# EAGLE design RH051.1 (EAGLE 7.7.0)
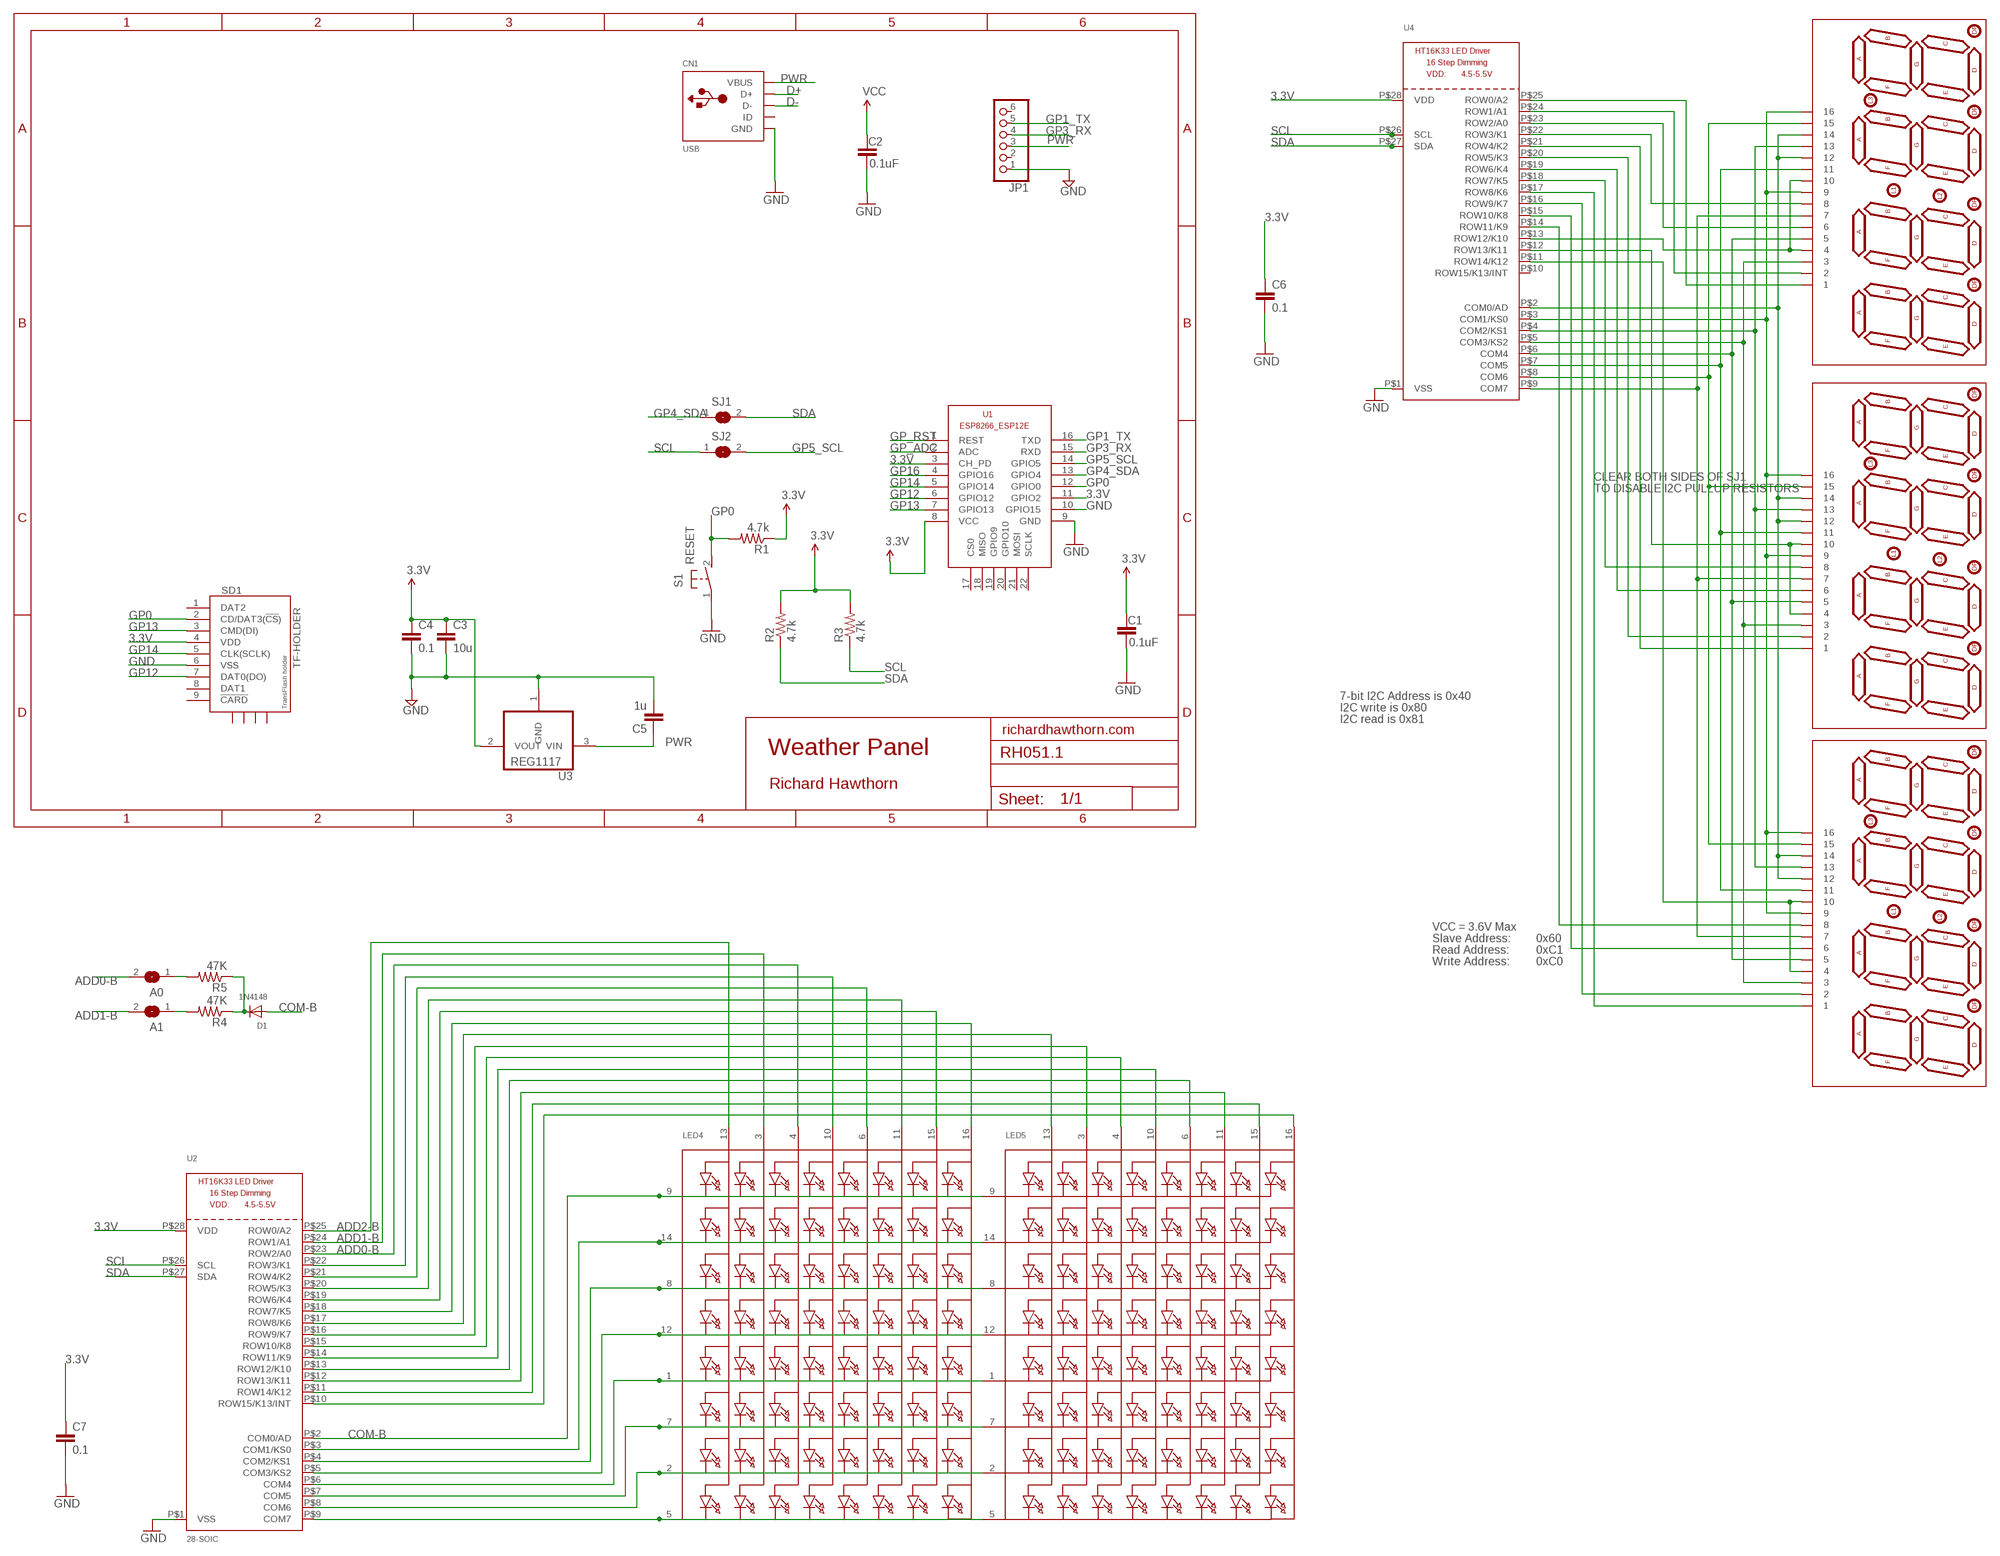
[diagram p0: schematic, sheet 1]

## Parts
A0  SOLDERJUMPERREFLOW_NOPASTE  [SOLDERJUMPER_REFLOW_NOPASTE]
A1  SOLDERJUMPERREFLOW_NOPASTE  [SOLDERJUMPER_REFLOW_NOPASTE]
C1  0.1uF  0.1UF-25V(+80/-20%)(0603)  [0603-CAP]
C2  0.1uF  0.1UF-25V(+80/-20%)(0603)  [0603-CAP]
C3  10u  CAP0805-CAP  [0805-CAP]
C4  0.1  CAP0603-CAP  [0603-CAP]
C5  1u  CAP0603-CAP  [0603-CAP]
C6  0.1  CAP0603-CAP  [0603-CAP]
C7  0.1  CAP0603-CAP  [0603-CAP]
CN1  USB  USBMINIB  [USB-MINIB]
D1  1N4148  DIODESOD-323F  [SOD-323F]
JP1  PINHD-1X6  [1X06]
LED1  7SEG-4DIGIT  [SPARKFUN_7-SEGMENT-4DIGIT]
LED2  7SEG-4DIGIT  [SPARKFUN_7-SEGMENT-4DIGIT]
LED3  7SEG-4DIGIT  [SPARKFUN_7-SEGMENT-4DIGIT]
LED4  DISP_SEGMENT_8X8_ROWCATHODEM12A881UR  [SEGMENT_BL-M12A881UR]
LED5  DISP_SEGMENT_8X8_ROWCATHODEM12A881UR  [SEGMENT_BL-M12A881UR]
R1  4.7k  RESISTOR0805-RES  [0805]
R2  4.7k  RESISTOR0805-RES  [0805]
R3  4.7k  RESISTOR0805-RES  [0805]
R4  47K  R-US_R0805  [R0805]
R5  47K  R-US_R0805  [R0805]
S1  RESET  DTSM-3  [DTSM-3]
SD1  TF-HOLDER  [TF-PULL]
SJ1  SJ  [SJ]
SJ2  SJ  [SJ]
U1  ESP8266-12EESP8266-ESP12E  [ESP8266-ESP12E]
U2  28-SOIC  HT16K33_SOP28  [SOP28_300MIL]
U3  REG1117  [SOT223]
U4  HT16K33_SOP28  [SOP28_300MIL]

## Nets
3.3V: C1.1 C2.1 C3.1 C4.1 C6.1 C7.1 R1.1 R2.2 R3.2 SD1.4(VDD) U1.3(CH_PD) U1.8(VCC) U1.11(GPIO2) U2.P$28(VDD) U3.2(VOUT) U4.P$28(VDD) ; supply symbol labelled VCC
ADD0-A: LED1.6 U4.P$23(ROW2/A0)
ADD0-B: A0.2 LED4.4(A3) U2.P$23(ROW2/A0)
ADD1-A: LED1.2 U4.P$24(ROW1/A1)
ADD1-B: A1.2 LED4.3(A2) U2.P$24(ROW1/A1)
ADD2-A: LED1.1 U4.P$25(ROW0/A2)
ADD2-B: LED4.13(A1) U2.P$25(ROW0/A2)
COM-A: LED1.12 LED1.14 LED2.12 LED2.14 LED3.12 LED3.14 U4.P$2(COM0/AD)
COM-B: D1.A LED4.9(K1) LED5.9(K1) U2.P$2(COM0/AD)
D+: CN1.D+
D-: CN1.D-
GND [power]: C1.2 C2.2 C3.2 C4.2 C5.2 C6.2 C7.2 CN1.GND JP1.1 S1.1 SD1.6(VSS) U1.9(GND) U1.10(GPIO15) U2.P$1(VSS) U3.1(GND) U4.P$1(VSS)
GP0: R1.2 S1.2 SD1.2(CD/DAT3(!CS!)) U1.12(GPIO0)
GP1_TX: JP1.5 U1.16(TXD)
GP3_RX: JP1.4 U1.15(RXD)
GP4_SDA: SJ1.1 U1.13(GPIO4)
GP5_SCL: SJ2.2 U1.14(GPIO5)
GP12: SD1.7(DAT0(DO)) U1.6(GPIO12)
GP13: SD1.3(CMD(DI)) U1.7(GPIO13)
GP14: SD1.5(CLK(SCLK)) U1.5(GPIO14)
GP16: U1.4(GPIO16)
GP_ADC: U1.2(ADC)
GP_RST: U1.1(REST)
N$1: LED4.5(K8) LED5.5(K8) U2.P$9(COM7)
N$2: LED4.2(K7) LED5.2(K7) U2.P$8(COM6)
N$3: LED4.7(K6) LED5.7(K6) U2.P$7(COM5)
N$4: LED1.9 LED1.16 LED2.9 LED2.16 LED3.9 LED3.16 U4.P$3(COM1/KS0)
N$5: LED1.13 LED2.13 LED3.13 U4.P$4(COM2/KS1)
N$6: LED1.3 LED2.3 LED3.3 U4.P$5(COM3/KS2)
N$7: LED1.5 LED2.5 LED3.5 U4.P$6(COM4)
N$8: LED1.11 LED2.11 LED3.11 U4.P$7(COM5)
N$9: LED1.15 LED2.15 LED3.15 U4.P$8(COM6)
N$10: LED1.7 LED2.7 LED3.7 U4.P$9(COM7)
N$11: LED4.1(K5) LED5.1(K5) U2.P$6(COM4)
N$12: LED4.8(K3) LED5.8(K3) U2.P$4(COM2/KS1)
N$13: LED4.14(K2) LED5.14(K2) U2.P$3(COM1/KS0)
N$14: LED1.8 U4.P$22(ROW3/K1)
N$15: LED2.1 U4.P$21(ROW4/K2)
N$16: LED2.2 U4.P$20(ROW5/K3)
N$17: LED2.6 U4.P$19(ROW6/K4)
N$18: LED2.8 U4.P$18(ROW7/K5)
N$19: LED3.1 U4.P$17(ROW8/K6)
N$21: LED3.2 U4.P$16(ROW9/K7)
N$22: LED3.6 U4.P$15(ROW10/K8)
N$23: LED3.8 U4.P$14(ROW11/K9)
N$24: LED1.4 LED1.10 U4.P$13(ROW12/K10)
N$25: LED2.4 LED2.10 U4.P$12(ROW13/K11)
N$26: LED3.4 LED3.10 U4.P$11(ROW14/K12)
N$28: LED5.15(A7) U2.P$11(ROW14/K12)
N$29: LED5.11(A6) U2.P$12(ROW13/K11)
N$30: LED4.16(A8) U2.P$18(ROW7/K5)
N$31: LED4.15(A7) U2.P$19(ROW6/K4)
N$32: LED4.6(A5) U2.P$21(ROW4/K2)
N$33: LED4.10(A4) U2.P$22(ROW3/K1)
N$34: LED5.16(A8) U2.P$10(ROW15/K13/INT)
N$35: LED4.11(A6) U2.P$20(ROW5/K3)
N$36: LED4.12(K4) LED5.12(K4) U2.P$5(COM3/KS2)
N$37: A1.1 R4.2
N$38: LED5.13(A1) U2.P$17(ROW8/K6)
N$39: LED5.3(A2) U2.P$16(ROW9/K7)
N$40: LED5.10(A4) U2.P$14(ROW11/K9)
N$41: LED5.4(A3) U2.P$15(ROW10/K8)
N$42: LED5.6(A5) U2.P$13(ROW12/K10)
N$43: A0.1 R5.2
N$44: D1.C R4.1 R5.1
PWR [power]: C5.1 CN1.VBUS JP1.3 U3.3(VIN)
SCL: R3.1 SJ2.1 U2.P$26(SCL) U4.P$26(SCL)
SDA: R2.1 SJ1.2 U2.P$27(SDA) U4.P$27(SDA)
Unconnected: CN1.ID JP1.2 JP1.6 SD1.1(DAT2) SD1.8(DAT1) SD1.9(!CARD) SD1.S1 SD1.S2 SD1.S3 SD1.S4 U1.17(CS0) U1.18(MISO) U1.19(GPIO9) U1.20(GPIO10) U1.21(MOSI) U1.22(SCLK) U4.P$10(ROW15/K13/INT)

## Notes on the sheet
- CLEAR BOTH SIDES OF SJ1
- TO DISABLE I2C PULLUP RESISTORS
- 7-bit I2C Address is 0x40
- I2C write is 0x80
- I2C read is 0x81
- richardhawthorn.com
- Weather Panel
- Richard Hawthorn
- VCC = 3.6V Max
- Slave Address: | 0x60
- Read Address: | 0xC1
- Write Address: | 0xC0

## Library data of the parts
A0 A1 = microbuilder:SOLDERJUMPER: SMD Solder JUMPER Solder the two pads together to create a connection, or remove the solder to break it. REFLOW - Use this footprint for solder paste and reflow ovens. WAVE - Use this footprint for hand-soldering (larger pads). CLOSED - Has a trace between the two pads to ensure it is closed by default. The trace needs to be cut to disable the jumper, and can be closed again by creating a solder bridge between the two pads.
C1 C2 = SparkFun-Capacitors:0.1UF-25V(+80/-20%)(0603): Ceramic Standard decoupling cap CAP-00810; PROD_ID: CAP-00810
C3-C7 = LowPowerLab:CAP: Capacitor Standard 0603 ceramic capacitor, and 0.1" leaded capacitor.
CN1 = LowPowerLab:USB: USB Connectors USBMINIB - Surface Mount Female Mini-B USB Connector 4UConnector: 06564 By microbuilder.eu Thru-hole RA Female Mini-B USB Connector 4UConnector: 18732 By ladyada.net
D1 = adafruit:DIODE: Diode SMADIODE - SMA Surface Mount Package 20V 1A Schottky Diode Digikey: 641-1014-6-ND DO-1N4148 - Through Hole Small Current Diode SOD-123 20V 1 A (.5mV Vf) Schottky Diode - Digikey: MBRX120TPMSCT-ND SOD-323 10V 570mA (.38mV Vf, 3ns) Schottky Diode - Digikey: ZLLS410CT-ND SOD-523 30V 30mA Schottky Diode (RB751S-40TE61) - Digikey: RB751S-40TE61CT-ND SOT23-R/W - SOT23 Package (R = Solder Paste/Reflow Ovens, W = Hand-Soldering) BAT54Film 40V 300mA - Digikey: 497-7162-1-ND
JP1 = Richards:PINHD-1X6: PIN HEADER
LED1-LED3 = sparkfun-4digit-sseg:7SEG-4DIGIT
LED4 LED5 = microbuilder:DISP_SEGMENT_8X8_ROWCATHODE: 8x8 LED Segment Displays: Row = Cathode 0.7" Red 8X8 Matrix, 1.9mm Round LEDs - BL-M07C881UR 1.2" Red 8x8 Matrix, 3.0mm Round LEDs - BL-M12A881UR 1.2" Red 8x8 Matrix, 3.0mm Square LEDs - BL-M12A883
R1-R3 = SparkFun:RESISTOR: Resistor Basic schematic elements and footprints for 0603, 1206, and PTH resistors.
R4 R5 = adafruit:R-US_: RESISTOR, American symbol
S1 = switch-tact:DTSM-3
SD1 = sd_mmc:TF-HOLDER: TF / Micro SD socket is PUSH-PUSH type, the card can be pushed into and auto locked and pushed out by simply press the card. Surface Mounting type.
SJ1 SJ2 = jumper:SJ: SMD solder JUMPER
U1 = ESP8266-ESP12E:ESP8266-12E: ESP8266-12E with additional I/O and GPIO04/05 corrected The author cannot warrant that this library is free from error or will meet your specific requirements. Created by PuceBaboon.com. Komagane, Nagano, JAPAN
U2 U4 = microbuilder:HT16K33_SOP28
U3 = burr-brown:REG1117: 800mA and 1A Low Dropout (LDO) Positive Regulator 1.8V, 2.5V, 2.85V, 3.3V, 5V, and Adj; MPN: REG1117; OC_FARNELL: 1097566; OC_NEWARK: 14P6981

## Net classes
1 power: width 0.381 mm, clearance 0.254 mm

## Board
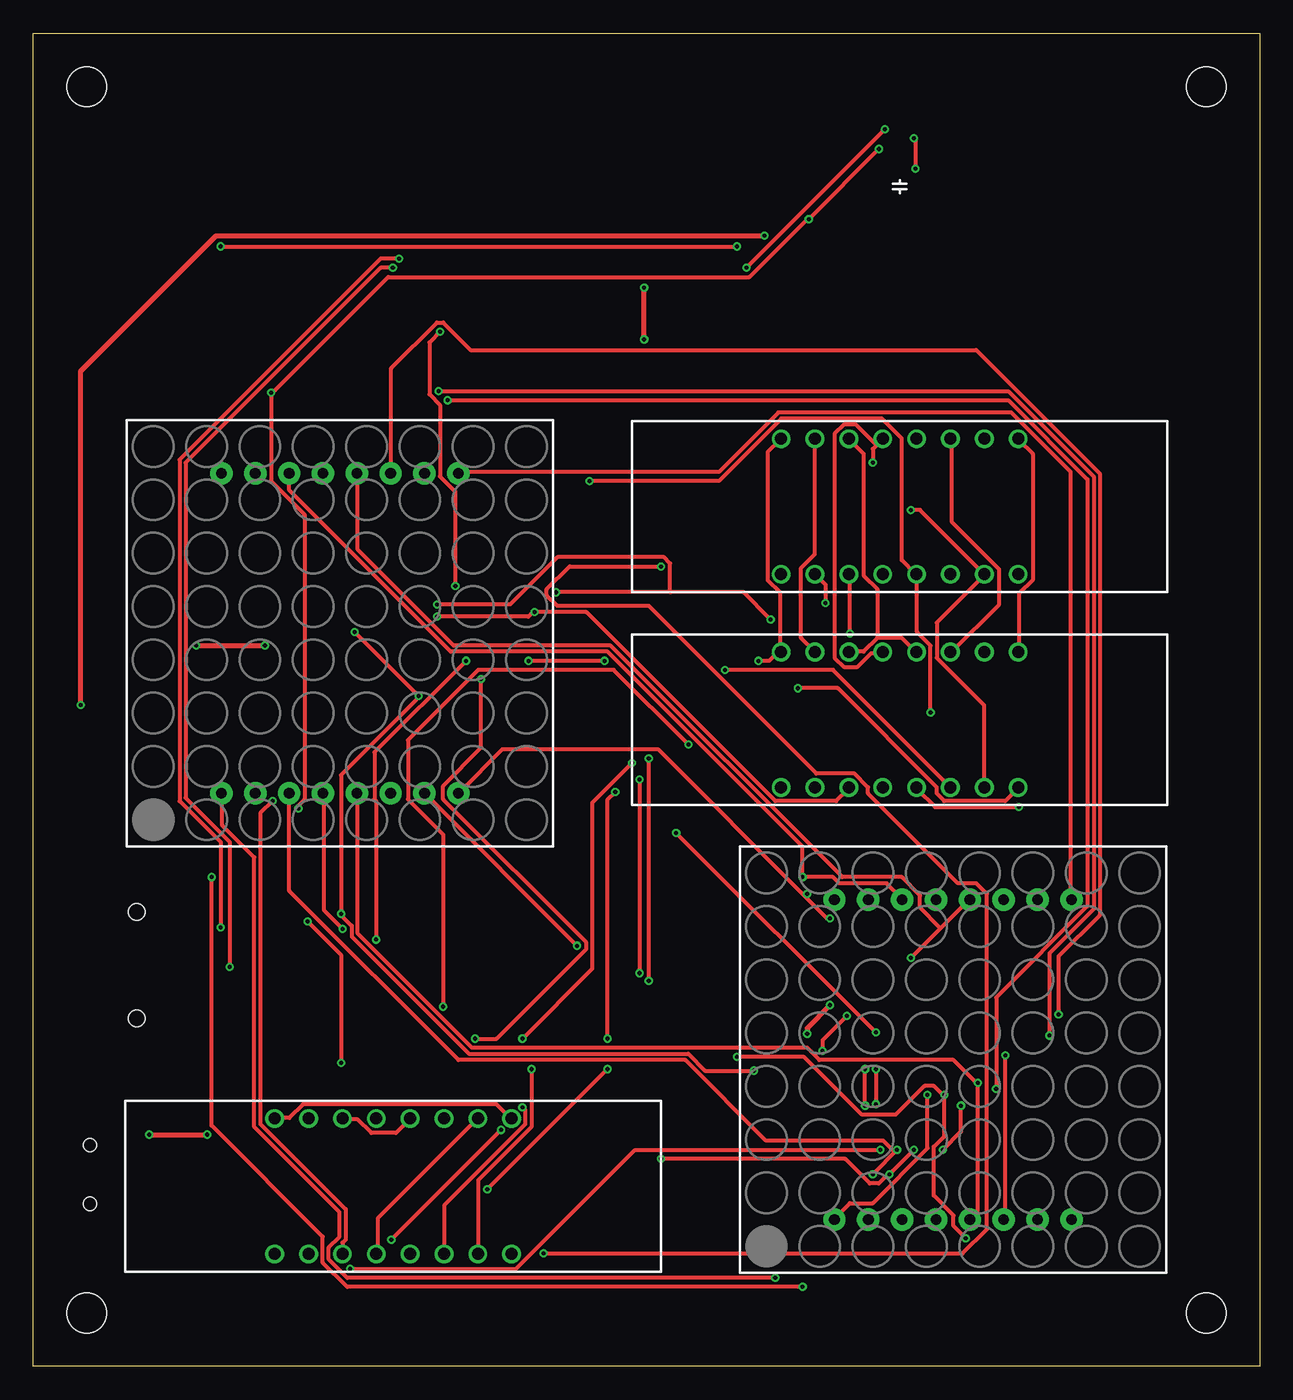
[diagram p1: board, top side]
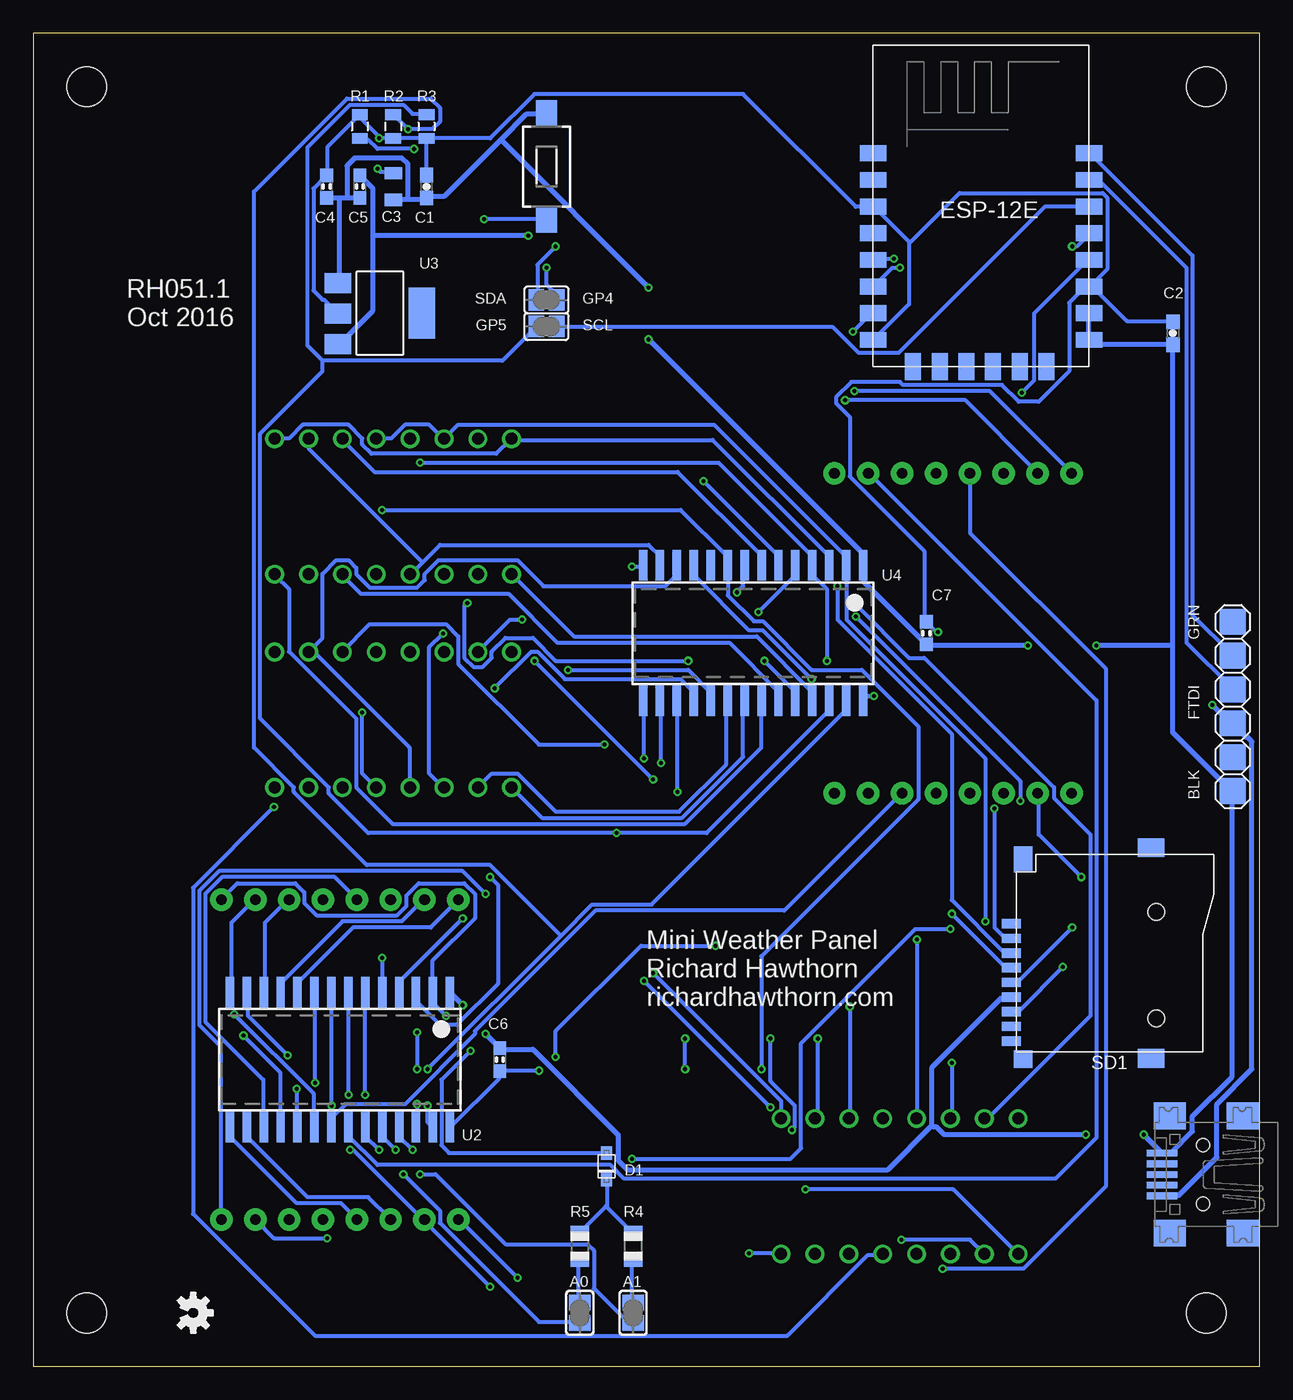
[diagram p2: board, bottom side, seen from below]

Size 92 x 100 mm. Coordinates in mm from the lower left corner, seen from the top.
Outline: 0,0 0,100 92,100 92,0 0,0
Copper layers (1*16): Top 0.035mm / dielectric 1.5mm / Bottom 0.035mm
Design rules "ITEADstudio_DRC *": minimum track width 12mil, minimum drill 12mil, track to track 6mil, track to pad 6mil, pad to pad 6mil, via to via 6mil, smd to smd 0mil, copper to edge 10mil, drill to drill 10mil, minimum pad ring 10mil, minimum via ring 6mil, stop-mask expansion 2mil, vias tented up to drill 100mil, thermal gap 15mil
Holes 3 mm at 4,96 88,96 4,4 88,4
tRestrict: area 0,92 to 35,100; area 0,0 to 8,8; area 84,0 to 92,8; area 84,92 to 92,100
bRestrict: area 0,92 to 35,100; area 84,92 to 92,100; area 84,0 to 92,8; area 0,0 to 8,8

### Footprints (pad centres in the part's own frame; a part is rotated, then mirrored left to right if it is on the bottom)
SOLDERJUMPER_REFLOW_NOPASTE = smd 1.168 x 1.6: 1 -0.762,0; 2 0.762,0
0603-CAP = smd 1.1 x 1: 1 -0.85,0; 2 0.85,0
0805-CAP = smd 0.902 x 1.3: 1 -1,0; 2 1,0
0603-CAP' = smd 1.016 x 0.965: 1 -0.85,0; 2 0.85,0
USB-MINIB = smd 0.5 x 2.308: D+ 0,4.064; D- -0.8,4.064; GND 1.6,4.064; ID 0.8,4.064; VBUS -1.6,4.064 | smd 2 x 2.4: GND1 -4.4,-2; GND2 -4.4,3.5; GND3 4.4,3.5; GND4 4.4,-2 | hole 1: -2.2,1; 2.2,1
SOD-323F = smd 1 x 0.8: A -1,0; C 1,0
1X06 = smd 1.93 x 1.93: 1 -6.35,0; 2 -3.81,0; 3 -1.27,0; 4 1.27,0; 5 3.81,0; 6 6.35,0
SPARKFUN_7-SEGMENT-4DIGIT = drill 0.9: 1 -8.89,-5.08; 2 -6.35,-5.08; 3 -3.81,-5.08; 4 -1.27,-5.08; 5 1.27,-5.08; 6 3.81,-5.08; 7 6.35,-5.08; 8 8.89,-5.08; 9 8.89,5.08; 10 6.35,5.08; 11 3.81,5.08; 12 1.27,5.08; 13 -1.27,5.08; 14 -3.81,5.08; 15 -6.35,5.08; 16 -8.89,5.08
SEGMENT_BL-M12A881UR = drill 0.8 pad 1.676: 1 -8.89,-12; 2 -6.35,-12; 3 -3.81,-12; 4 -1.27,-12; 5 1.27,-12; 6 3.81,-12; 7 6.35,-12; 8 8.89,-12; 9 8.89,12; 10 6.35,12; 11 3.81,12; 12 1.27,12; 13 -1.27,12; 14 -3.81,12; 15 -6.35,12; 16 -8.89,12
0805 = smd 0.8 x 1.2: 1 -0.9,0; 2 0.9,0
R0805 = smd 1.1 x 1.4: 1 -1,0; 2 1,0
DTSM-3 = smd 2 x 1.6: 1 -3.97,0; 2 3.97,0
TF-PULL = smd 0.7 x 1.4: 1 -2.2,-7.62; 2 -1.1,-7.62; 3 0,-7.62; 4 1.1,-7.62; 5 2.2,-7.62; 6 3.3,-7.62; 7 4.4,-7.62; 8 5.5,-7.62; 9 6.6,-7.62 | smd 1.4 x 2: S1 -7.9,2.85; S2 7.9,2.85 | smd 1.28 x 1.4: S3 7.96,-6.75 | smd 1.95 x 1.4: S4 -7.025,-6.75 | hole 1.25: -3.1,3.25; 4.9,3.25
SJ = smd 1.168 x 1.6: 1 -0.762,0; 2 0.762,0
ESP8266-ESP12E = smd 2 x 1.2: 1 0,16; 2 0,14; 3 0,12; 4 0,10; 5 0,8; 6 0,6; 7 0,4; 8 0,2; 9 16.2,2; 10 16.2,4; 11 16.2,6; 12 16.2,8; 13 16.2,10; 14 16.2,12; 15 16.2,14; 16 16.2,16 | smd 1.2 x 2: 17 11,0; 18 3,0; 19 5,0; 20 13,0; 21 7,0; 22 9,0
SOP28_300MIL = smd 0.635 x 2.286: P$1 -8.255,-5.08; P$2 -6.985,-5.08; P$3 -5.715,-5.08; P$4 -4.445,-5.08; P$5 -3.175,-5.08; P$6 -1.905,-5.08; P$7 -0.635,-5.08; P$8 0.635,-5.08; P$9 1.905,-5.08; P$10 3.175,-5.08; P$11 4.445,-5.08; P$12 5.715,-5.08; P$13 6.985,-5.08; P$14 8.255,-5.08; P$15 8.255,5.08; P$16 6.985,5.08; P$17 5.715,5.08; P$18 4.445,5.08; P$19 3.175,5.08; P$20 1.905,5.08; P$21 0.635,5.08; P$22 -0.635,5.08; P$23 -1.905,5.08; P$24 -3.175,5.08; P$25 -4.445,5.08; P$26 -5.715,5.08; P$27 -6.985,5.08; P$28 -8.255,5.08
SOT223 = smd 1.499 x 2.007: 1 -2.261,-3.15; 2 0.025,-3.15; 3 2.311,-3.15 | smd 3.81 x 2.007: 4 0,3.15

### Placement (x,y rotation side)
A0  51,4 270 bottom
A1  47,4 270 bottom
C1  62.5,88.5 270 bottom
C2  6.5,77.5 270 bottom
C3  65,88.5 270 bottom
C4  0.1  [0603-CAP']  70,88.5 270 bottom
C5  1u  [0603-CAP']  67.5,88.5 270 bottom
C6  0.1  [0603-CAP']  57,23 90 bottom
C7  0.1  [0603-CAP']  25,55 270 bottom
CN1  3.25,14.38 90 bottom
D1  49,15 270 bottom
JP1  2,49.5 90 bottom
LED1  65,64.5 0 top
LED2  65,48.5 0 top
LED3  27,13.5 0 top
LED4  23,55 0 top
LED5  69,23 0 top
R1  67.5,93 270 bottom
R2  65,93 270 bottom
R3  62.5,93 270 bottom
R4  47,9 270 bottom
R5  51,9 270 bottom
S1  53.5,90 270 bottom
SD1  11,31 270 bottom
SJ1  53.5,80 0 bottom
SJ2  53.5,78 0 bottom
U1  29,75 0 bottom
U2  69,23 180 bottom
U3  66,79 270 bottom
U4  38,55 180 bottom
U$3  [OSHW-LOGO-S]  80,4 270 bottom

### Tracks (layer width: path | path; a pad name or v marks a point on that pad's centre or on a via)
3.3V  (via drill 0.3)
  Top 0.305: v24.12,55.09 v28.92,50.29 28.92,50.18 23.09,44.35 v23.09,33.95 23.09,33.83 23.89,33.03 23.89,32.23 32.69,23.43 49.15,23.43 50.41,22.17 v54.06,22.17 | v66.18,89.84 66.18,92.01 v66.06,92.13
  Bottom 0.305: U2.P$28 60.69,17.95 57.04,21.6 57.04,22.06 C6.1 56.92,22.17 v54.06,22.17 | v24.12,55.09 24.23,55.09 24.92,55.78 C7.1 25.15,55.89 25.15,61.15 30.75,66.75 30.75,71.21 31.77,72.24 31.77,72.69 30.63,73.84 26.98,73.84 26.75,73.61 19.32,73.61 18.06,72.35 16.57,72.35 14.29,74.64 14.29,79.78 13.14,80.92 12.92,80.92 U1.11 | v28.92,50.29 29.38,50.29 29.72,49.95 U4.P$28 | v23.09,33.95 19.09,29.95 18.63,29.95 SD1.4 | C1.1 62.52,89.38 62.52,92.01 R3.2 | R3.2 62.64,92.13 64.92,92.13 R2.2 65.15,92.13 v66.06,92.13 66.06,92.24 67.55,93.73 R1.1 67.55,93.84 69.95,91.44 69.95,89.38 C4.1 70.07,89.27 70.98,88.35 70.98,80.7 70.29,80.01 70.18,80.01 U3.2 | v66.18,89.84 65.95,89.61 65.04,89.61 C3.1 | C2.1 6.51,78.41 9.94,78.41 12.46,80.92 12.69,80.92 U1.11 | 26.29,84.35 26.29,79.67 28.92,77.04 U1.8 | 26.29,84.35 28.92,86.98 U1.3 29.15,86.98 30.29,86.98 38.75,95.44 54.41,95.44 57.72,92.13 62.41,92.13 R3.2 | U1.11 12.46,81.04 12.46,81.27 11.43,82.3 11.43,87.67 11.77,88.01 22.52,88.01 26.18,84.35 26.29,84.35
ADD0-A
  Bottom 0.305: U4.P$23 36.12,49.95 36.12,50.63 39.78,54.29 52.69,54.29 56.35,57.95 67.44,57.95 68.81,59.32 LED1.6
ADD0-B  (via drill 0.3)
  Top 0.305: v66.06,16.23 v64.24,14.4 64.12,14.4 63.44,13.72 62.75,13.72 60.92,15.54 v47.09,15.54 | v23.2,32.8 21.83,34.18 21.83,42.98 LED4.4
  Bottom 0.305: v64.24,14.4 61.49,11.66 61.49,10.74 54.06,3.31 51.09,3.31 A0.2 | v66.06,16.23 67.09,17.26 67.09,17.83 U2.P$23 | v23.2,32.8 25.83,32.8 34.4,24.23 34.4,16.34 35.2,15.54 v47.09,15.54
ADD1-A  (via drill 0.3)
  Top 0.305: v42.86,52.92 v37.15,52.92 | v59.44,57.26 59.44,58.64 58.75,59.32 LED1.2
  Bottom 0.305: v37.15,52.92 34.86,50.63 34.86,49.95 U4.P$24 | v42.86,52.92 52.81,52.92 54.52,54.63 56.58,54.63 57.61,53.61 57.61,53.15 58.29,52.46 58.98,52.46 59.66,53.15 59.66,57.04 v59.44,57.26
ADD1-B  (via drill 0.3)
  Top 0.305: v62.98,14.4 v64.81,16.23 64.58,16.12 63.78,16.92 54.98,16.92 48.92,22.97 31.89,22.97 19.2,35.66 19.2,42.98 LED4.3
  Bottom 0.305: v62.98,14.4 61.84,14.4 56.58,9.14 50.41,9.14 49.95,8.69 49.95,5.83 47.43,3.31 47.09,3.31 A1.2 | v64.81,16.23 65.72,17.14 65.72,17.83 U2.P$24
ADD2-A
  Bottom 0.305: U4.P$25 33.6,49.95 33.6,50.63 37.72,54.75 51.44,54.75 56.01,59.32 LED1.1
ADD2-B  (via drill 0.3)
  Top 0.305: v63.55,16.23 45.15,16.23 36.23,7.32 v23.77,7.32
  Bottom 0.305: v63.55,16.23 64.47,17.14 64.47,17.83 U2.P$25 | v23.77,7.32 17.72,7.32 11.54,13.49 11.54,52.35 21.72,62.52 21.72,66.98 LED4.13
COM-A  (via drill 0.3)
  Top 0.305: 63.32,54.63 62.29,53.61 61.27,53.61 LED2.14 | 63.32,54.63 65.15,54.63 66.18,53.61 LED2.12 | LED3.14 23.2,18.52 24.35,18.52 25.38,17.49 27.2,17.49 28.23,18.52 LED3.12 | v23.09,22.75 23.09,30.86 v20.57,33.38 | 63.32,54.63 63.32,58.29 62.29,59.32 62.29,68.47 61.27,69.49 LED1.14
  Bottom 0.305: LED1.12 66.18,69.61 65.15,69.61 64.12,70.64 62.29,70.64 61.27,69.61 LED1.14 61.15,69.61 60.12,70.64 40.92,70.64 31.09,60.81 31.09,60.12 U4.P$2 30.98,60.01 30.98,56.01 20.57,45.61 v20.57,33.38 | v23.09,22.75 23.09,18.63 LED3.14
COM-B  (via drill 0.3)
  Top 0.305: v59.21,23.66 59.21,24.46 v61.04,26.29 | LED4.9 32,67.09 51.44,67.09 55.89,71.55 73.38,71.55 77.84,67.09 77.84,35.09 LED5.9
  Bottom 0.305: v59.21,23.66 61.38,21.49 61.38,16.57 60.81,16 49.03,16 D1.A | v61.04,26.29 61.95,27.2 61.95,28 U2.P$2 62.06,28.23 62.06,30.4 58.86,33.6 58.86,35.43 59.66,36.23 63.09,36.23 64.01,35.32 64.01,34.52 64.69,33.83 70.75,33.83 71.67,34.75 71.67,35.55 72.35,36.23 76.69,36.23 77.84,35.09 LED5.9
GND  (via drill 0.3)
  Top 0.381: v58.06,24.92 58.06,25.38 v59.78,27.09 | v12.23,54.06 v17.37,54.06 | v45.83,77.04 v45.83,80.92 | v8.69,17.37 v13.03,17.37
  Bottom 0.381: v58.06,24.92 57.04,23.89 C6.2 56.92,23.77 54.52,23.77 48.12,17.37 48.12,15.43 47.43,14.74 27.89,14.74 24.57,18.06 | v59.78,27.09 60.69,28 U2.P$1 | 24.57,18.06 24.57,22.4 19.32,27.66 18.63,27.66 SD1.6 | 69.04,87.67 69.95,87.67 C4.2 | 69.04,87.67 68.47,87.67 | 68.47,87.67 67.55,87.67 C5.2 | 69.04,87.67 69.04,81.27 U3.1 | 63.89,87.55 64.92,87.55 C3.2 | 63.89,87.55 62.52,87.55 C1.2 62.41,87.78 61.15,87.78 56.92,92.01 | 56.92,92.01 54.98,93.95 53.61,93.95 S1.1 | 68.47,87.67 68.47,90.07 67.89,90.64 64.35,90.64 63.89,90.18 63.89,87.55 | U1.10 12.8,78.98 12.8,77.15 U1.9 12.69,76.92 12.46,76.69 6.51,76.69 C2.2 6.51,76.47 6.51,54.06 | 6.51,54.06 6.51,47.55 2.17,43.2 JP1.1 2.06,43.09 2.06,21.72 5.03,18.75 5.03,17.6 6.63,16 7.2,16 CN1.GND 7.43,16.12 v8.69,17.37 | v17.37,54.06 24.92,54.06 C7.2 25.03,54.18 29.72,58.86 29.72,60.01 U4.P$1 29.83,60.24 29.83,61.04 v45.83,77.04 | 6.51,54.06 v12.23,54.06 | v45.83,80.92 56.92,92.01 | v13.03,17.37 23.66,17.37 24.23,17.95 24.46,17.95 24.57,18.06
GP0  (via drill 0.3)
  Top 0.305: v63.44,91.33 v58.18,86.07 58.06,86.07 53.72,81.72 26.63,81.72 17.95,73.04 v17.83,73.04 17.83,66.41 20.34,63.89 20.34,42.52 19.89,42.06 v19.89,41.83
  Bottom 0.305: v63.44,91.33 66.18,91.33 66.86,92.01 67.44,92.01 R1.2 | v58.18,86.07 53.61,86.07 S1.2 | v19.89,41.83 19.89,32.92 19.09,32.12 18.63,32.12 SD1.2 | v17.83,73.04 16.92,73.95 16.92,78.98 12.8,83.1 U1.12
GP1_TX
  Bottom 0.305: JP1.5 2.06,53.38 5.03,56.35 5.03,83.33 12.69,90.98 U1.16
GP3_RX
  Bottom 0.305: JP1.4 2.06,50.86 5.49,54.29 5.49,82.41 12,88.92 12.69,88.92 U1.15
GP4_SDA  (via drill 0.3)
  Top 0.305: v14.06,84.01 v52.81,84.01
  Bottom 0.305: v52.81,84.01 54.18,82.64 54.18,80.01 SJ1.1 | v14.06,84.01 13.72,84.01 12.8,84.92 U1.13
GP5_SCL
  Bottom 0.305: SJ2.2 52.69,77.95 32,77.95 30.06,76.01 27.09,76.01 16.12,86.98 12.8,86.98 U1.14
GP12  (via drill 0.3)
  Top 0.305: v14.74,29.95 14.74,39.32 11.43,42.63 11.43,67.78 26.06,82.41 v26.98,82.41
  Bottom 0.305: v14.74,29.95 18.06,26.63 18.52,26.63 SD1.7 | v26.98,82.41 27.55,82.41 28.92,81.04 U1.6
GP13  (via drill 0.3)
  Top 0.305: v31.66,58.52 31.66,65.61 30.52,66.75 30.52,72.12 29.72,72.92 29.72,76.81 v30.52,77.61
  Bottom 0.305: v31.66,58.52 31.66,56.01 23.09,47.43 23.09,34.98 19.2,31.09 18.63,31.09 SD1.3 | v30.52,77.61 29.03,79.1 U1.7
GP14  (via drill 0.3)
  Top 0.305: v14.06,32.92 14.06,39.32 10.97,42.41 10.97,68.01 26.06,83.1 v27.43,83.1
  Bottom 0.305: v14.06,32.92 18.17,28.8 18.52,28.8 SD1.5 | v27.43,83.1 28.92,83.1 U1.5
N$1  (via drill 0.3)
  Top 0.305: LED5.5 70.29,11.09 70.87,11.66 v70.87,21.26 70.75,21.26 69.04,22.97 58.98,22.97 58.06,23.89 32.92,23.89 24.35,32.46 24.35,42.98 LED4.5
  Bottom 0.305: v70.87,21.26 70.87,28 U2.P$9
N$2  (via drill 0.3)
  Top 0.305: v69.61,19.55 69.61,17.6 v68.24,16.23 | v13.37,36.69 13.37,18.06 21.72,9.72 21.72,7.77 23.55,5.94 v57.72,5.94
  Bottom 0.305: v69.61,19.55 69.61,28 U2.P$8 | v68.24,16.23 68.01,16.23 62.75,10.97 LED5.2 62.64,10.86 v57.72,5.94 | v13.37,36.69 16.57,39.89 16.57,42.98 LED4.2
N$3  (via drill 0.3)
  Top 0.305: v69.95,9.6 69.04,10.52 69.04,11.32 67.55,12.8 67.55,16.46 68.35,17.26 v68.35,20.34 68.24,20.34 67.55,21.03 66.86,21.03 64.69,18.86 62.18,18.86 57.84,23.2 v52.81,23.2 | v40.8,31.55 29.38,42.98 LED4.7
  Bottom 0.305: v68.35,20.34 68.35,28 U2.P$7 | v69.95,9.6 73.95,9.6 75.32,10.97 LED5.7 | v40.8,31.55 46.41,31.55 52.81,25.15 v52.81,23.2
N$4  (via drill 0.3)
  Top 0.305: LED3.16 18.17,18.63 19.2,18.63 20.23,19.66 34.75,19.66 35.78,18.63 LED3.9 | LED2.9 73.95,53.61 73.95,57.95 74.98,58.98 74.98,68.47 73.95,69.49 LED1.9 | LED1.16 56.01,69.49 55.09,68.58 55.09,58.98 56.01,58.06 56.01,53.61 LED2.16 55.89,53.61 55.21,52.92 v54.41,52.92 | v45.49,44.01 v45.49,29.49
  Bottom 0.305: U4.P$3 32.35,60.12 32.35,60.81 41.03,69.49 56.01,69.49 LED1.16 56.24,69.49 57.26,68.47 66.64,68.47 67.32,69.15 67.32,69.61 68.35,70.64 71.78,70.64 72.81,69.61 73.84,69.61 LED1.9 | v45.49,29.49 35.89,19.89 35.89,18.63 LED3.9 | v54.41,52.92 v45.49,44.01
N$5  (via drill 0.3)
  Top 0.305: v62.98,67.78 62.98,68.81 63.66,69.49 LED1.13 63.21,69.15 61.72,70.64 60.81,70.64 60.12,69.95 60.12,53.15 60.81,52.46 61.84,52.46 62.87,53.49 63.66,53.49 LED2.13 | v25.72,32 25.72,42.41 25.6,42.52 25.6,46.06 v32.46,52.92
  Bottom 0.305: v62.98,67.78 40.58,67.78 33.6,60.81 33.6,60.12 U4.P$4 33.49,60.01 33.49,59.32 32.46,58.29 v32.46,52.92 | v25.72,32 25.72,18.63 LED3.13
N$6  (via drill 0.3)
  Top 0.305: LED2.3 61.15,43.32 60.24,42.41 55.66,42.41 41.49,56.58 v37.6,56.58 37.49,56.58 37.15,56.24 v30.29,56.24 | v17.95,42.41 17.03,41.49 17.03,18.17 23.43,11.77 23.43,9.49 23.2,9.26 23.2,8.46 LED3.3 | v61.27,54.98 61.27,59.32 LED1.3
  Bottom 0.305: v37.6,56.58 34.86,59.32 34.86,60.01 U4.P$5 | v17.95,42.41 17.95,43.89 v30.29,56.24 | v61.27,54.98 62.29,53.95 62.29,44.46 61.27,43.43 LED2.3
N$7  (via drill 0.3)
  Top 0.305: v41.72,66.41 51.44,66.41 56.12,71.09 63.66,71.09 65.15,69.61 65.15,60.47 66.18,59.44 LED1.5 66.29,59.32 66.29,55.09 67.32,54.06 v67.32,49.03 | v73.95,41.95 67.67,41.95 66.29,43.32 LED2.5
  Bottom 0.305: v41.72,66.41 36.12,60.81 36.12,60.12 U4.P$6 | v73.95,41.95 80.01,35.89 80.01,11.43 70.87,2.29 35.43,2.29 29.38,8.34 28.35,8.34 LED3.5 | v67.32,49.03 67.32,44.46 66.29,43.43 LED2.5
N$8  (via drill 0.3)
  Top 0.305: v30.75,26.98 30.75,39.89 28.12,42.52 28.12,46.98 33.38,52.23 43.55,52.23 v49.15,46.63 | LED1.11 68.92,69.49 68.92,63.32 72.47,59.78 72.47,57.15 68.92,53.61 LED2.11
  Bottom 0.305: U4.P$7 37.38,60.12 37.38,60.81 43.66,67.09 66.41,67.09 68.81,69.49 LED1.11 | v30.75,26.98 30.75,18.63 LED3.11 | v49.15,46.63 54.06,46.63 60.12,52.69 60.12,54.75 61.04,55.66 66.75,55.66 68.81,53.61 LED2.11
N$9  (via drill 0.3)
  Top 0.305: 47.78,58.06 53.26,58.06 v55.32,56.01 | 47.78,58.06 v39.2,58.06 | v30.29,57.15 35.78,57.15 39.32,60.69 47.32,60.69 47.78,60.24 47.78,58.06 | LED1.15 58.64,69.49 58.64,60.92 57.61,59.89 57.61,54.63 58.64,53.61 LED2.15
  Bottom 0.305: v39.2,58.06 38.75,58.52 38.75,60.01 U4.P$8 | v55.32,56.01 56.24,56.01 58.64,53.61 LED2.15 | v30.29,57.15 26.29,53.15 25.15,53.15 15.43,43.43 15.43,42.63 12.69,39.89 12.69,26.29 20.34,18.63 20.57,18.63 LED3.15
N$10  (via drill 0.3)
  Top 0.305: v65.84,64.24 66.52,64.24 71.32,59.44 LED1.7 71.32,59.32 67.78,55.78 67.78,53.15 71.32,49.61 71.32,43.43 LED2.7 | v37.38,22.29 37.38,17.95 33.38,13.95 33.38,8.46 LED3.7
  Bottom 0.305: v65.84,64.24 43.43,64.24 40.01,60.81 40.01,60.12 U4.P$9 39.89,60.01 39.89,57.84 37.95,55.89 37.26,55.89 33.6,52.23 29.83,52.23 25.6,48.01 25.6,42.52 37.38,30.75 v37.38,22.29
N$11  (via drill 0.3)
  Top 0.305: v67.09,20.34 67.09,16.34 62.98,12.23 61.27,12.23 60.12,11.09 LED5.1 | v55.66,6.63 23.55,6.63 22.17,8 22.17,8.91 22.97,9.72 22.97,11.54 16.57,17.95 16.57,38.18 14.17,40.58 14.17,42.98 LED4.1
  Bottom 0.305: v67.09,20.34 67.09,28 U2.P$6 | v55.66,6.63 60.01,10.97 LED5.1
N$12  (via drill 0.3)
  Top 0.305: v59.78,33.6 59.55,33.6 57.89,35.26 | 57.89,35.26 46.86,46.29 35.2,46.29 32,43.09 LED4.8 | 57.89,35.26 v58.06,35.43
  Bottom 0.305: v59.78,33.6 64.47,28.92 64.47,28.12 U2.P$4 | v58.06,35.43 59.78,37.15 78.07,37.15 79.55,35.66 79.55,25.6 77.95,24 77.95,11.09 LED5.8
N$13  (via drill 0.3)
  Top 0.305: LED5.14 65.15,35.09 64.01,36.23 60.47,36.23 60.01,36.69 v57.72,36.69 57.72,38.98 43.09,53.61 31.32,53.61 19.2,65.72 19.2,66.98 LED4.14
  Bottom 0.305: v57.72,36.69 57.15,36.12 57.15,28.69 60.24,25.6 61.49,25.6 63.21,27.32 63.21,28 U2.P$3
N$14
  Bottom 0.305: U4.P$22 37.38,49.84 37.38,46.41 43.09,40.69 65.04,40.69 67.78,43.43 67.78,48.58 72.81,53.61 72.81,58.29 73.84,59.32 LED1.8
N$15
  Bottom 0.305: U4.P$21 38.75,49.84 38.75,45.72 43.32,41.15 53.84,41.15 56.01,43.32 LED2.1
N$16
  Bottom 0.305: U4.P$20 40.01,49.84 40.01,45.15 43.55,41.6 52.81,41.6 55.66,44.46 57.61,44.46 58.64,43.43 LED2.2
N$17  (via drill 0.3)
  Top 0.305: v51.89,52.23 60.01,52.23 68.81,43.43 LED2.6
  Bottom 0.305: v51.89,52.23 42.86,52.23 41.26,50.63 41.26,49.95 U4.P$19
N$18  (via drill 0.3)
  Top 0.305: v57.38,50.86 60.35,50.86 67.78,43.43 67.78,42.98 68.35,42.41 72.92,42.41 73.84,43.32 LED2.8
  Bottom 0.305: v57.38,50.86 54.63,53.61 54.18,53.61 52.12,51.55 43.43,51.55 42.52,50.63 42.52,49.95 U4.P$18
N$19  (via drill 0.3)
  Top 0.305: v43.66,43.09 43.09,42.52 v43.09,24.57 | v34.06,13.26 v43.09,22.29
  Bottom 0.305: v43.66,43.09 43.66,49.84 U4.P$17 | v43.09,22.29 v43.09,24.57 | v34.06,13.26 22.97,13.26 18.17,8.46 LED3.1
N$21  (via drill 0.3)
  Top 0.305: v44.92,45.26 41.95,42.29 41.95,29.83 v36.69,24.57 | v26.86,9.49 v35.09,17.72
  Bottom 0.305: v44.92,45.26 44.92,49.84 U4.P$16 | v36.69,24.57 36.69,21.37 34.86,19.55 34.86,17.95 v35.09,17.72 | v26.86,9.49 21.72,9.49 20.69,8.46 LED3.2
N$22  (via drill 0.3)
  Top 0.305: v46.18,28.92 v46.18,45.61 | v36.69,19.43 36.92,19.2 36.92,18.17 30.86,12.12 30.86,8.46 LED3.6
  Bottom 0.305: v46.18,45.61 46.18,49.84 U4.P$15 | v36.69,19.43 v46.18,28.92
N$23  (via drill 0.3)
  Top 0.305: v47.09,60.01 40.23,60.01 38.52,58.29 38.52,57.84 39.32,57.04 46.18,57.04 58.75,44.46 61.61,44.46 62.64,43.43 62.64,42.98 69.38,36.23 70.75,36.23 71.55,35.43 71.55,10.29 69.72,8.46 v38.29,8.46
  Bottom 0.305: v47.09,60.01 46.29,60.01 U4.P$14 | v38.29,8.46 35.89,8.46 LED3.8
N$24
  Bottom 0.305: 62.81,60.29 63.66,59.44 LED1.4 | 62.81,60.29 61.49,61.61 45.83,61.61 45.03,60.81 45.03,60.12 U4.P$13 | 62.81,60.29 71.32,68.81 71.32,69.49 LED1.10
N$25
  Bottom 0.305: U4.P$12 43.78,60.01 43.78,59.32 44.58,58.52 53.72,58.52 55.66,60.47 61.61,60.47 62.64,59.44 62.64,58.98 63.21,58.41 66.75,58.41 67.78,59.44 67.78,59.89 68.35,60.47 69.27,60.47 70.29,59.44 70.29,54.63 71.32,53.61 LED2.10 71.09,53.72 63.78,46.41 63.78,43.43 LED2.4
N$26  (via drill 0.3)
  Top 0.305: v33.6,51.55 33.6,46.41 30.75,43.55 30.75,42.52 41.49,31.77 41.49,31.32 34.75,24.57 v33.15,24.57 | LED3.4 25.83,8.46 25.83,11.09 33.26,18.52 LED3.10
  Bottom 0.305: v33.6,51.55 37.26,55.21 38.29,55.21 42.41,59.32 42.41,60.01 U4.P$11 | v33.15,24.57 33.15,18.75 33.26,18.63 LED3.10
N$28
  Bottom 0.305: U2.P$11 73.38,28.12 73.38,28.8 68.81,33.38 64.35,33.38 62.75,34.98 LED5.15
N$29
  Bottom 0.305: U2.P$12 74.64,28.12 74.64,33.26 72.92,34.98 LED5.11
N$30  (via drill 0.3)
  Top 0.305: v76.24,24.8 76.24,30.98 79.55,34.29 79.55,66.75 73.15,73.15 v30.4,73.15
  Bottom 0.305: v76.24,24.8 73.5,22.06 73.5,17.95 U2.P$18 | v30.4,73.15 20.23,73.15 14.17,67.09 LED4.16
N$31  (via drill 0.3)
  Top 0.305: v72.24,20.8 72.24,27.66 79.1,34.52 79.1,66.52 73.15,72.47 v31.09,72.47
  Bottom 0.305: v72.24,20.8 72.24,17.95 U2.P$19 | v31.09,72.47 22.06,72.47 16.69,67.09 LED4.15
N$32
  Bottom 0.305: U2.P$21 69.61,17.95 69.61,18.63 68.58,19.66 64.12,19.66 58.86,24.92 58.86,25.15 49.84,34.18 35.66,34.18 26.86,42.98 LED4.6
N$33
  Bottom 0.305: U2.P$22 68.35,17.83 68.35,17.26 66.18,15.09 48.69,15.09 47.66,14.06 15.32,14.06 12.23,17.14 12.23,49.95 29.26,66.98 LED4.10
N$34
  Bottom 0.305: U2.P$10 72.12,28.12 72.12,28.8 68.01,32.92 62.18,32.92 60.12,34.98 LED5.16
N$35  (via drill 0.3)
  Top 0.305: v76.92,26.4 76.92,30.75 80.01,33.83 80.01,66.98 70.75,76.24 32.8,76.24 30.75,78.3 30.29,78.3 26.86,74.87 26.86,67.09 LED4.11
  Bottom 0.305: v76.92,26.4 70.98,20.46 70.98,17.95 U2.P$20
N$36  (via drill 0.3)
  Top 0.305: 68.07,32.86 70.18,34.98 LED5.12 | 68.07,32.86 v65.84,30.63 | 68.07,32.86 66.52,34.4 66.52,35.32 65.15,36.69 60.69,36.69 43.32,54.06 31.55,54.06 24.35,61.27 24.35,66.98 LED4.12
  Bottom 0.305: v65.84,30.63 65.84,28.12 U2.P$5
N$37
  Bottom 0.305: R4.2 47.09,7.89 47.09,4.8 A1.1
N$38
  Bottom 0.305: U2.P$17 74.75,17.95 74.75,21.49 79.1,25.83 79.1,35.43 77.84,36.69 69.38,36.69 67.78,35.09 LED5.13
N$39
  Bottom 0.305: U2.P$16 75.89,17.83 75.89,17.14 71.44,12.69 66.86,12.69 65.27,11.09 LED5.3
N$40
  Bottom 0.305: U2.P$14 77.15,28.12 77.15,33.26 75.44,34.98 LED5.10
N$41
  Bottom 0.305: U2.P$15 77.15,17.83 77.15,17.14 72.24,12.23 68.92,12.23 67.78,11.09 LED5.4
N$42  (via drill 0.3)
  Top 0.305: v72.92,23.32 72.92,11.09 LED5.6
  Bottom 0.305: v72.92,23.32 75.89,26.29 75.89,28 U2.P$13
N$43
  Bottom 0.305: R5.2 51.09,7.89 51.09,4.8 A0.1
N$44
  Bottom 0.305: 48.92,12 48.92,11.89 47.09,10.06 R4.1 | 48.92,12 48.92,13.95 D1.C | R5.1 50.98,10.06 49.03,12 48.92,12
PWR  (via drill 0.3)
  Top 0.381: v54.86,84.81 13.72,84.81 3.54,74.64 v3.54,49.61
  Bottom 0.381: 66.52,84.81 66.52,79.21 69.04,76.69 U3.3 | 66.52,84.81 66.52,88.35 67.44,89.27 C5.1 | CN1.VBUS 7.2,12.8 6.06,12.8 3.2,15.66 3.2,19.66 0.57,22.29 0.57,46.86 0.91,47.21 1.03,47.21 1.94,48.12 JP1.3 2.17,48.23 v3.54,49.61 | v54.86,84.81 66.52,84.81
SCL  (via drill 0.3)
  Top 0.305: v63.21,22.29 v63.21,19.66 | v48.23,40.01 v63.21,25.03
  Bottom 0.305: 70.29,75.44 71.44,76.58 71.44,91.44 68.24,94.64 64.24,94.64 63.55,93.95 62.52,93.95 R3.1 | 70.29,75.44 56.81,75.44 54.29,77.95 SJ2.1 | v63.21,19.66 63.21,17.95 U2.P$26 | v63.21,25.03 v63.21,22.29 | U4.P$26 32.35,49.84 32.35,49.15 41.49,40.01 v48.23,40.01 66.86,40.01 69.84,42.98 69.84,43.43 74.98,48.58 74.98,69.95 70.29,74.64 70.29,75.44
SDA  (via drill 0.3)
  Top 0.305: v53.49,82.41 v63.89,92.81 | v62.41,19.55 v62.41,22.29
  Bottom 0.305: v53.49,82.41 53.49,81.15 52.81,80.47 52.81,80.01 SJ1.2 | R2.1 64.92,93.84 v63.89,92.81 62.06,92.81 61.49,93.38 61.49,94.41 62.18,95.1 68.47,95.1 75.44,88.12 75.44,46.41 72.47,43.43 72.47,43.09 66.98,37.6 57.72,37.6 52.41,32.29 | v62.41,22.29 52.41,32.29 | 52.41,32.29 50.06,34.63 45.61,34.63 31.09,49.15 31.09,49.84 U4.P$27 | v62.41,19.55 62.41,18.29 62.06,17.95 U2.P$27

### Text on the board
bNames: GP4 | SDA | SCL | GP5 | RH051.1 / Oct 2016 | GRN | FTDI | BLK | Mini Weather Panel / Richard Hawthorn / richardhawthorn.com
tDocu: REG